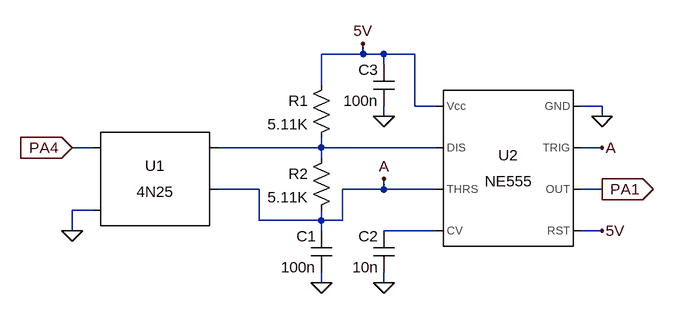
[diagram p0: schematic opto-to-555.asc]
opto-to-555.asc, the LTspice schematic file:
Version 4
SHEET 1 936 736
WIRE 400 48 400 32
WIRE 400 48 336 48
WIRE 432 48 400 48
WIRE 480 48 432 48
WIRE 432 64 432 48
WIRE 336 96 336 48
WIRE 480 128 480 48
WIRE 512 128 480 128
WIRE 768 128 736 128
WIRE 432 144 432 128
WIRE 768 144 768 128
WIRE -16 192 -48 192
WIRE 336 192 336 176
WIRE 336 192 176 192
WIRE 512 192 336 192
WIRE 768 192 736 192
WIRE 336 208 336 192
WIRE 240 256 176 256
WIRE 432 256 432 240
WIRE 432 256 368 256
WIRE 512 256 432 256
WIRE 768 256 736 256
WIRE -16 288 -48 288
WIRE 240 304 240 256
WIRE 336 304 336 288
WIRE 336 304 240 304
WIRE 368 304 368 256
WIRE 368 304 336 304
WIRE -48 320 -48 288
WIRE 336 320 336 304
WIRE 512 320 432 320
WIRE 768 320 736 320
WIRE 336 400 336 384
WIRE 432 400 432 384
FLAG 768 144 0
FLAG 336 400 0
FLAG 432 400 0
FLAG 768 320 5V
FLAG 432 144 0
FLAG 400 32 5V
FLAG -48 320 0
FLAG 432 240 A
FLAG 768 192 A
FLAG 768 256 PA1
IOPIN 768 256 Out
FLAG -48 192 PA4
IOPIN -48 192 In
SYMBOL Optos/4N25 80 256 R0
SYMATTR InstName U1
SYMBOL Misc/NE555 624 224 M0
SYMATTR InstName U2
SYMBOL res 352 80 M0
SYMATTR InstName R1
SYMATTR Value 5.11K
SYMBOL res 352 192 M0
SYMATTR InstName R2
SYMATTR Value 5.11K
SYMBOL cap 352 320 M0
SYMATTR InstName C1
SYMATTR Value 100n
SYMBOL cap 448 320 M0
SYMATTR InstName C2
SYMATTR Value 10n
SYMBOL cap 448 64 M0
SYMATTR InstName C3
SYMATTR Value 100n

The netlist it stands for:
* opto-to-555.asc
XU1 PA4 0 N001 A NC_01 4N25
XU2 0 A PA1 5V N002 A N001 5V NE555  ; pins GND TRIG OUT RST CV THRS DIS Vcc
R1 5V N001 5.11K
R2 N001 A 5.11K
C1 A 0 100n
C2 N002 0 10n
C3 5V 0 100n
.lib 4N25.sub
.lib NE555.sub
.backanno
.end